# Altium project PCB_METR4810.PrjPcb
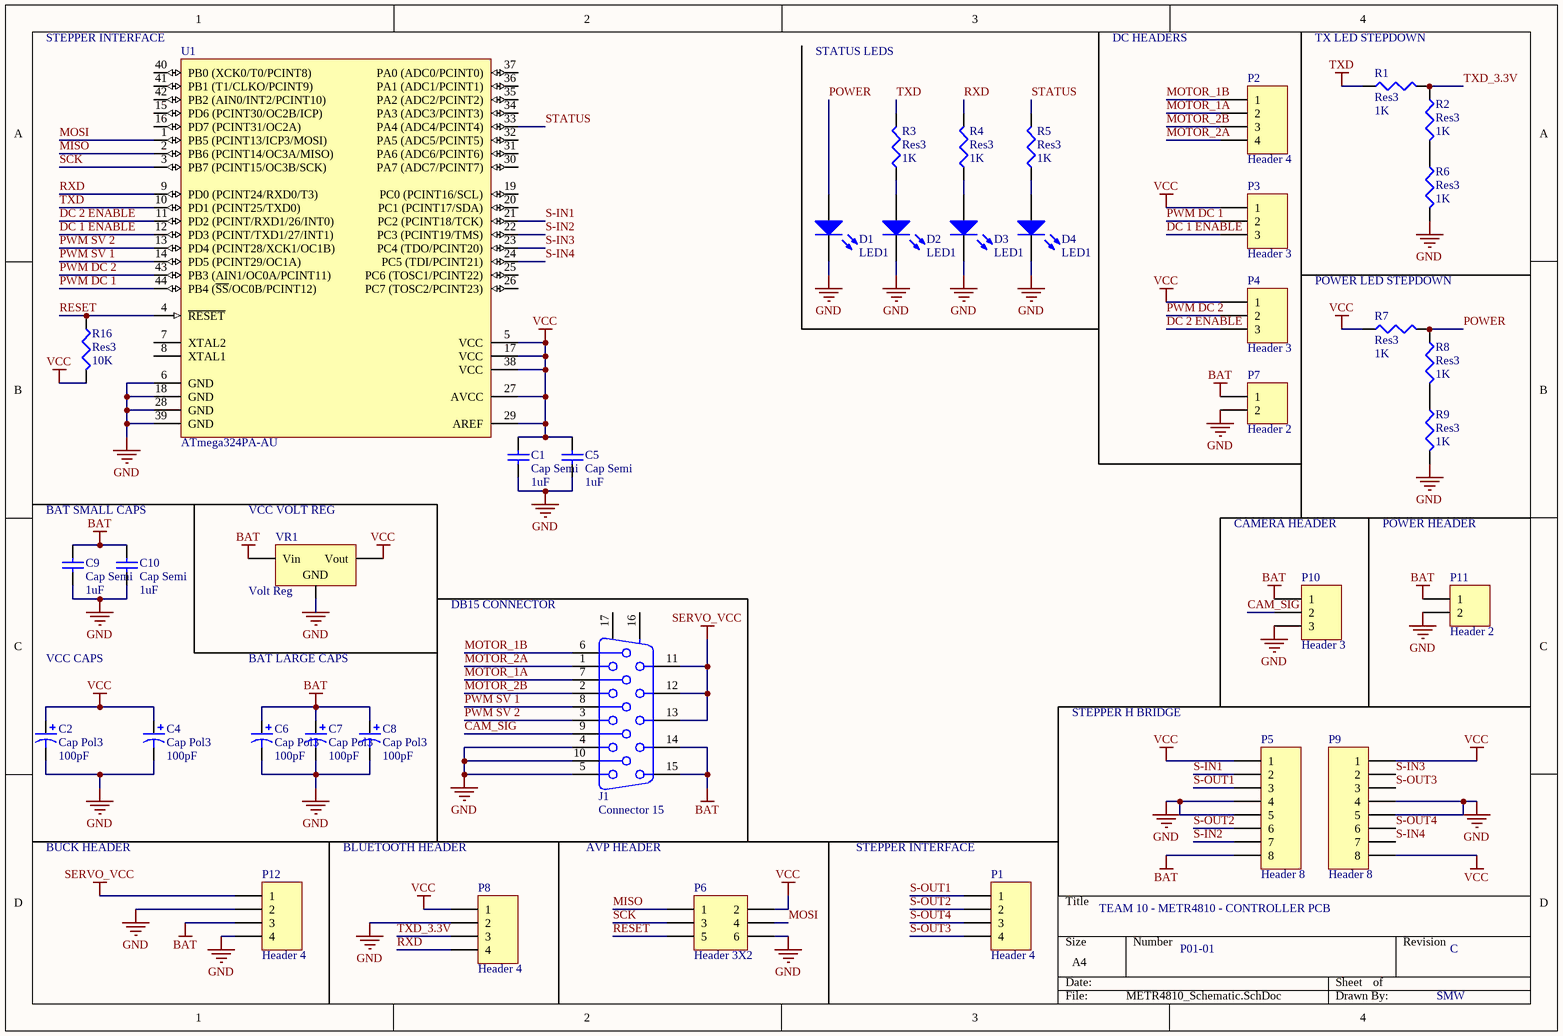
[diagram p0: METR4810_Schematic.SchDoc]
1 sheet, 38 parts. Net scope: global (net labels, ports and power ports of the same name join across sheets).
Board files: METR4810_PCBLayout.PcbDoc, METR4810_PCB_b_Layout.PcbDoc, METR4810_PCB_C_Layout.PcbDoc, VGA breakout.PcbDoc

## Sheet METR4810_Schematic.SchDoc
size A4

### Parts
C1  Cap Semi  value 1uF  [C1206]
C2  Cap Pol3  value 100pF  [C0805]
C4  Cap Pol3  value 100pF  [C0805]
C5  Cap Semi  value 1uF  [C1206]
C6  Cap Pol3  value 100pF  [C0805]
C7  Cap Pol3  value 100pF  [C0805]
C8  Cap Pol3  value 100pF  [C0805]
C9  Cap Semi  value 1uF  [C1206]
C10  Cap Semi  value 1uF  [C1206]
D1  LED1  [L0603]
D2  LED1  [L0603]
D3  LED1  [L0603]
D4  LED1  [L0603]
J1  Connector 15  [PCBComponent_1]
P1  Header 4  [HDR1X4]
P2  Header 4  [HDR1X4]
P3  Header 3  [HDR1X3]
P4  Header 3  [HDR1X3]
P5  Header 8  [HDR1X8]
P6  Header 3X2  [HDR2X3]
P7  Header 2  [HDR1X2]
P8  Header 4  [HDR1X4]
P9  Header 8  [HDR1X8]
P10  Header 3  [HDR1X3]
P11  Header 2  [HDR1X2]
P12  Header 4  [HDR1X4]
R1  Res3  value 1K  [J1-0603]
R2  Res3  value 1K  [J1-0603]
R3  Res3  value 1K  [J1-0603]
R4  Res3  value 1K  [J1-0603]
R5  Res3  value 1K  [J1-0603]
R6  Res3  value 1K  [J1-0603]
R7  Res3  value 1K  [J1-0603]
R8  Res3  value 1K  [J1-0603]
R9  Res3  value 1K  [J1-0603]
R16  Res3  value 10K  [J1-0603]
U1  ATmega324PA-AU  [44A_N]
VR1  Volt Reg  [D2PAK_N]

### Nets
BAT: C6.1 C7.1 C8.1 C9.2 C10.2 J1.14 J1.15 P5.8 P7.1 P10.1 P11.1 P12.3 VR1.1(Vin)
GND: C1.1 C2.2 C4.2 C5.1 C6.2 C7.2 C8.2 C9.1 C10.1 D1.2(K) D2.2(K) D3.2(K) D4.2(K) J1.4 J1.5 J1.10 P5.4 P5.5 P6.6 P7.2 P8.2 P9.4 P9.5 P10.3 P11.2 P12.2 P12.4 R6.2 R9.2 U1.6(GND) U1.18(GND) U1.28(GND) U1.39(GND) VR1.2(GND)
SERVO_VCC: J1.11 J1.12 J1.13 P12.1
TXD: R1.1 R3.2 U1.10(PD1_(PCINT25/TXD0))
VCC: C1.2 C2.1 C4.1 C5.2 P3.1 P4.1 P5.1 P6.2 P8.1 P9.1 P9.8 R7.1 R16.2 U1.5(VCC) U1.17(VCC) U1.27(AVCC) U1.29(AREF) U1.38(VCC) VR1.3(Vout)
CAM_SIG: J1.9 P10.2
DC 1 ENABLE: P3.3 U1.12(PD3_(PCINT/TXD1/27/INT1))
DC 2 ENABLE: P4.3 U1.11(PD2_(PCINT/RXD1/26/INT0))
MISO: P6.1 U1.2(PB6_(PCINT14/OC3A/MISO))
MOSI: P6.4 U1.1(PB5_(PCINT13/ICP3/MOSI))
MOTOR_1A: J1.7 P2.2
MOTOR_1B: J1.6 P2.1
MOTOR_2A: J1.1 P2.4
MOTOR_2B: J1.2 P2.3
POWER: D1.1(A) R7.2 R8.1
PWM DC 1: P3.2 U1.44(PB4_(~{SS}/OC0B/PCINT12))
PWM DC 2: P4.2 U1.43(PB3_(AIN1/OC0A/PCINT11))
PWM SV 1: J1.8 U1.14(PD5_(PCINT29/OC1A))
PWM SV 2: J1.3 U1.13(PD4_(PCINT28/XCK1/OC1B))
RESET: P6.5 R16.1 U1.4(~{RESET})
RXD: P8.4 R4.2 U1.9(PD0_(PCINT24/RXD0/T3))
S-IN1: P5.2 U1.21(PC2_(PCINT18/TCK))
S-IN2: P5.7 U1.22(PC3_(PCINT19/TMS))
S-IN3: P9.2 U1.23(PC4_(TDO/PCINT20))
S-IN4: P9.7 U1.24(PC5_(TDI/PCINT21))
S-OUT1: P1.1 P5.3
S-OUT2: P1.2 P5.6
S-OUT3: P1.4 P9.3
S-OUT4: P1.3 P9.6
SCK: P6.3 U1.3(PB7_(PCINT15/OC3B/SCK))
STATUS: R5.2 U1.33(PA4_(ADC4/PCINT4))
TXD_3.3V: P8.3 R1.2 R2.1
NetD2_1: D2.1(A) R3.1
NetD3_1: D3.1(A) R4.1
NetD4_1: D4.1(A) R5.1
NetR2_2: R2.2 R6.1
NetR8_2: R8.2 R9.1

Not connected (* = marked no-connect by the designer): J1 16(MH1) 17(MH2); U1 7(XTAL2) 8(XTAL1) 15(PD6_(PCINT30/OC2B/ICP)) 16(PD7_(PCINT31/OC2A)) 19(PC0_(PCINT16/SCL)) 20(PC1_(PCINT17/SDA)) 25(PC6_(TOSC1/PCINT22)) 26(PC7_(TOSC2/PCINT23)) 30(PA7_(ADC7/PCINT7)) 31(PA6_(ADC6/PCINT6)) 32(PA5_(ADC5/PCINT5)) 34(PA3_(ADC3/PCINT3)) 35(PA2_(ADC2/PCINT2)) 36(PA1_(ADC1/PCINT1)) 37(PA0_(ADC0/PCINT0)) 40(PB0_(XCK0/T0/PCINT8)) 41(PB1_(T1/CLKO/PCINT9)) 42(PB2_(AIN0/INT2/PCINT10))

### Notes on the sheet
- (near U1) STEPPER INTERFACE
- DC HEADERS
- TX LED STEPDOWN
- STATUS LEDS
- POWER LED STEPDOWN
- BAT SMALL CAPS
- (near VR1) VCC VOLT REG
- CAMERA HEADER
- POWER HEADER
- DB15 CONNECTOR
- VCC CAPS
- BAT LARGE CAPS
- STEPPER H BRIDGE
- BUCK HEADER
- BLUETOOTH HEADER
- AVP HEADER
- (near P1) STEPPER INTERFACE
- TEAM 10 - METR4810 - CONTROLLER PCB
- P01-01
- C
- SMW

### Library data of the parts
C1 C5 C9 C10 = Cap Semi: Capacitor (Semiconductor SIM Model); Published: 8-Jun-2000; LatestRevisionDate: 29-May-2009; LatestRevisionNote: IPC-7351 Footprint Added.; PackageReference: C1206; Publisher: Altium Limited; PackageDescription: Chip Capacitor
C2 C4 C6-C8 = Cap Pol3: Polarized Capacitor (Surface Mount); Published: 8-Jun-2000; LatestRevisionDate: 29-May-2009; LatestRevisionNote: IPC-7351 Footprint Added.; PackageReference: C0805; Publisher: Altium Limited; PackageDescription: Chip Capacitor
D1-D4 = LED1: Typical RED GaAs LED; Published: 8-Jun-2000; LatestRevisionDate: 08-Jul-2005; LatestRevisionNote: Mech Layer 1 removed.; PackageReference: LED-1; Publisher: Altium Limited; PackageDescription: LED; 2 Leads
J1 = Connector 15: Receptacle Assembly, 15-Pin, Sim Line Connector; PackageDocument: B; Positions: 15; Gender: Receptacle Header; Published: 15-Jun-2001; LatestRevisionDate: 17-Jul-2002; LatestRevisionNote: Re-released for DXP Platform.; DatasheetDocument: 24-Nov-1999; PackageReference: 788574; Publisher: Altium Limited; Orientation: Right Angle
P1 P2 P8 P12 = Header 4: Header, 4-Pin; LatestRevisionDate: 17-Jul-2002; LatestRevisionNote: Re-released for DXP Platform.; Publisher: Altium Limited
P3 P4 P10 = Header 3: Header, 3-Pin; LatestRevisionDate: 17-Jul-2002; LatestRevisionNote: Re-released for DXP Platform.; Publisher: Altium Limited
P5 P9 = Header 8: Header, 8-Pin; LatestRevisionDate: 17-Jul-2002; LatestRevisionNote: Re-released for DXP Platform.; Publisher: Altium Limited
P6 = Header 3X2: Header, 3-Pin, Dual row; LatestRevisionDate: 17-Jul-2002; LatestRevisionNote: Re-released for DXP Platform.; Publisher: Altium Limited
P7 P11 = Header 2: Header, 2-Pin; LatestRevisionDate: 17-Jul-2002; LatestRevisionNote: Re-released for DXP Platform.; Publisher: Altium Limited
R1-R9 R16 = Res3: Resistor; Published: 8-Jun-2000; LatestRevisionDate: 29-May-2009; LatestRevisionNote: IPC-7351 Footprint Added.; PackageReference: J1-0603; Publisher: Altium Limited; PackageDescription: Chip Resistor
U1 = ATmega324PA-AU: 8-bit AVR Microcontroller, 32KB Flash, 1KB EEPROM, 2KB SRAM, 44-pin TQFP, Industrial Grade (-40°C to 85°C); DatasheetVersion: revC, Jun-2011; PackageVersion: revC, Oct-2010; PackageReference: 44A; PackageDescription: 44-Pin Plastic Thin Profile Quad Flat Pack, 10 x 10 x 1.0 mm Body, 0.8 mm Pitch (TQFP); Code_JEDEC: MS-026-ACB; ComponentLink1Description: Manufacturer URL; ComponentLink1URL: http://www.atmel.com/; ComponentLink2Description: ATmega164A/164PA/324A/324PA/644A/644PA/1284/1284P Datasheet; ComponentLink2URL: http://www.atmel.com/dyn/resources/prod_documents/doc8272.pdf; ComponentLink3Description: ATmega164A/164PA/324A/324PA/644A/644PA/1284/1284P Summary; ComponentLink3URL: http://www.atmel.com/dyn/resources/prod_documents/8272S.pdf
VR1 = Volt Reg: Voltage Regulator; Published: 24-Mar-1999; LatestRevisionDate: 29-May-2009; LatestRevisionNote: IPC-7351 Footprint Added.; PackageReference: D2PAK; Publisher: Altium Limited; PackageDescription: 3-Pin Transistor Outline Package 2.54 mm Pitch, 15.1 mm Lead Span